# Altium schematic sheet USB.SchDoc
size 558 x 431 mm; SheetNumber: 16; SheetTotal: 25; Sheet_Name: USB; Size: 11x17
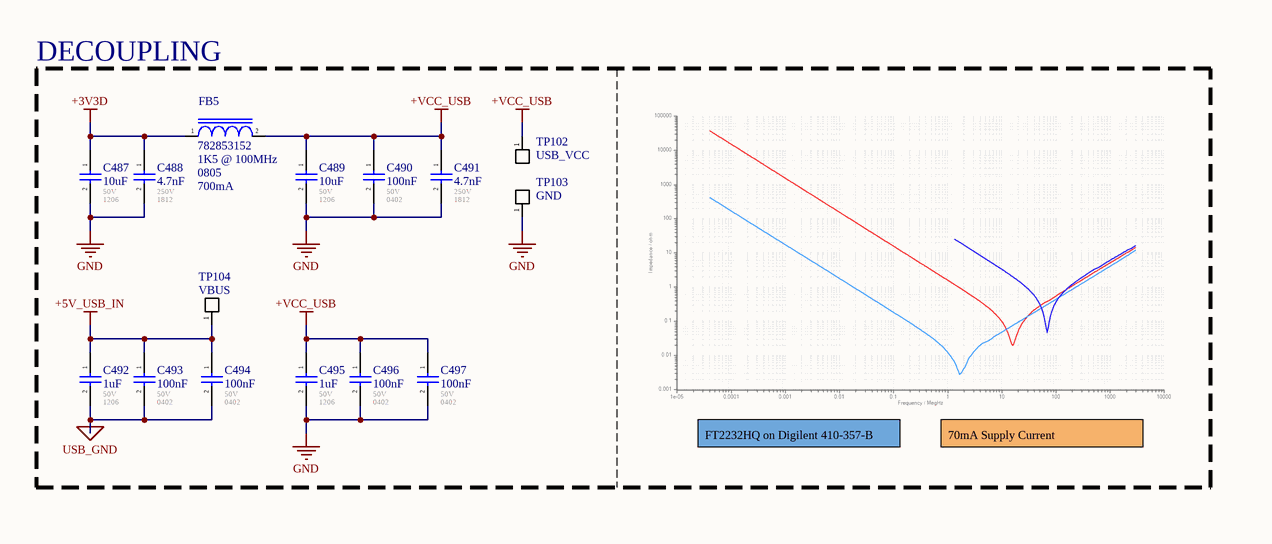
[diagram p0: USB.SchDoc, top left]
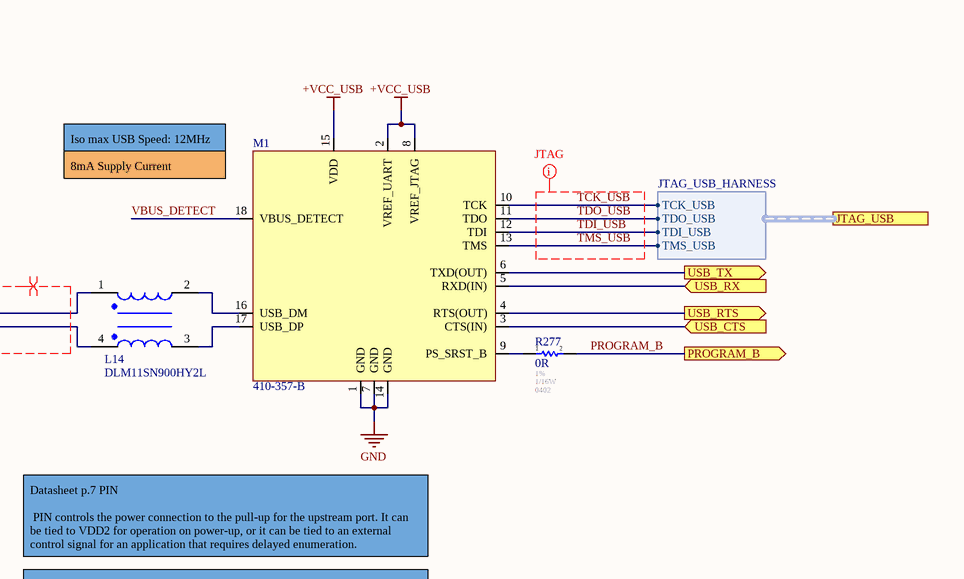
[diagram p1: USB.SchDoc, top right]
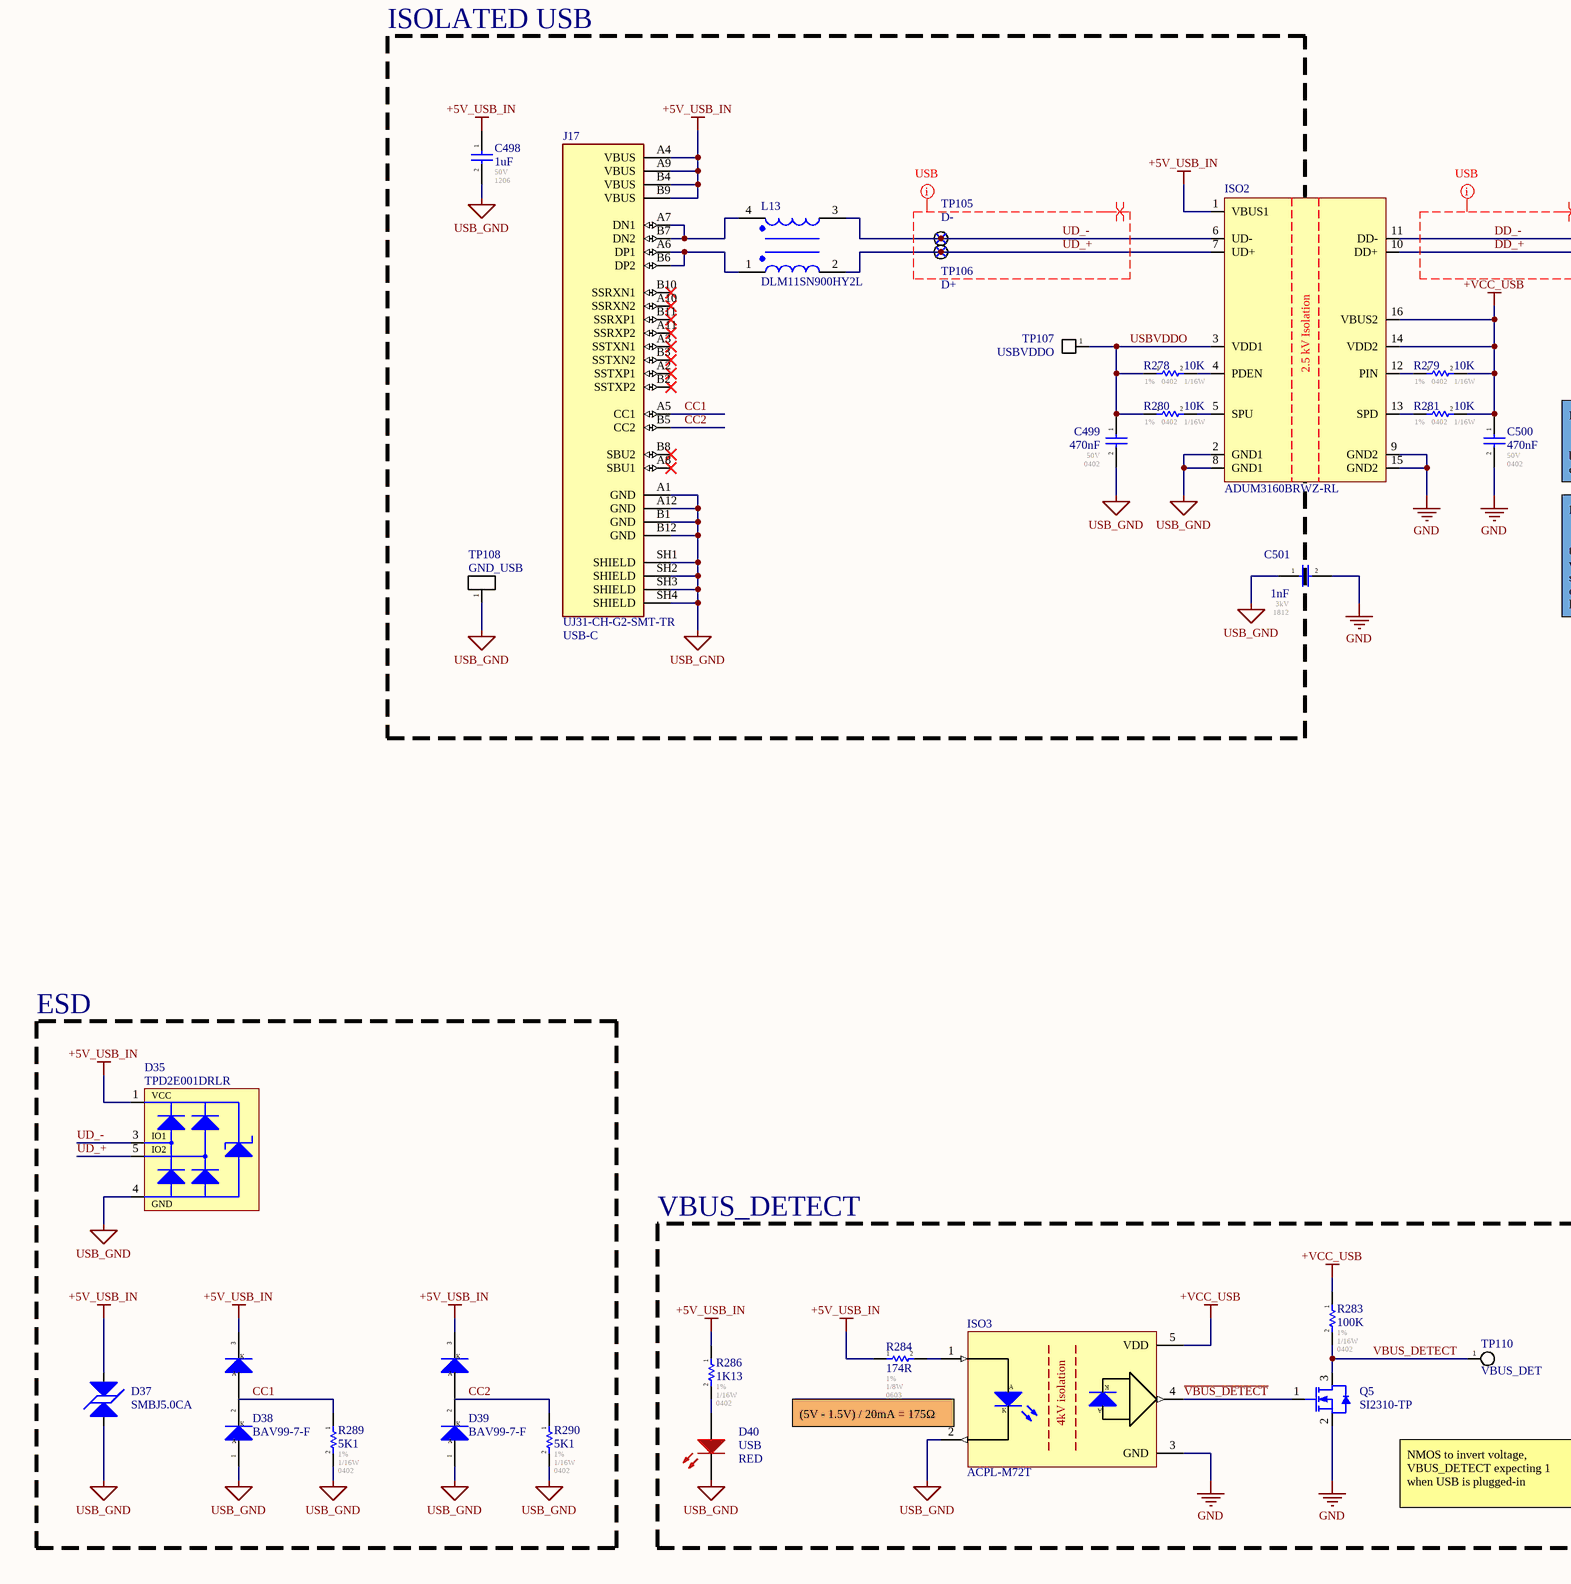
[diagram p2: USB.SchDoc, bottom left]
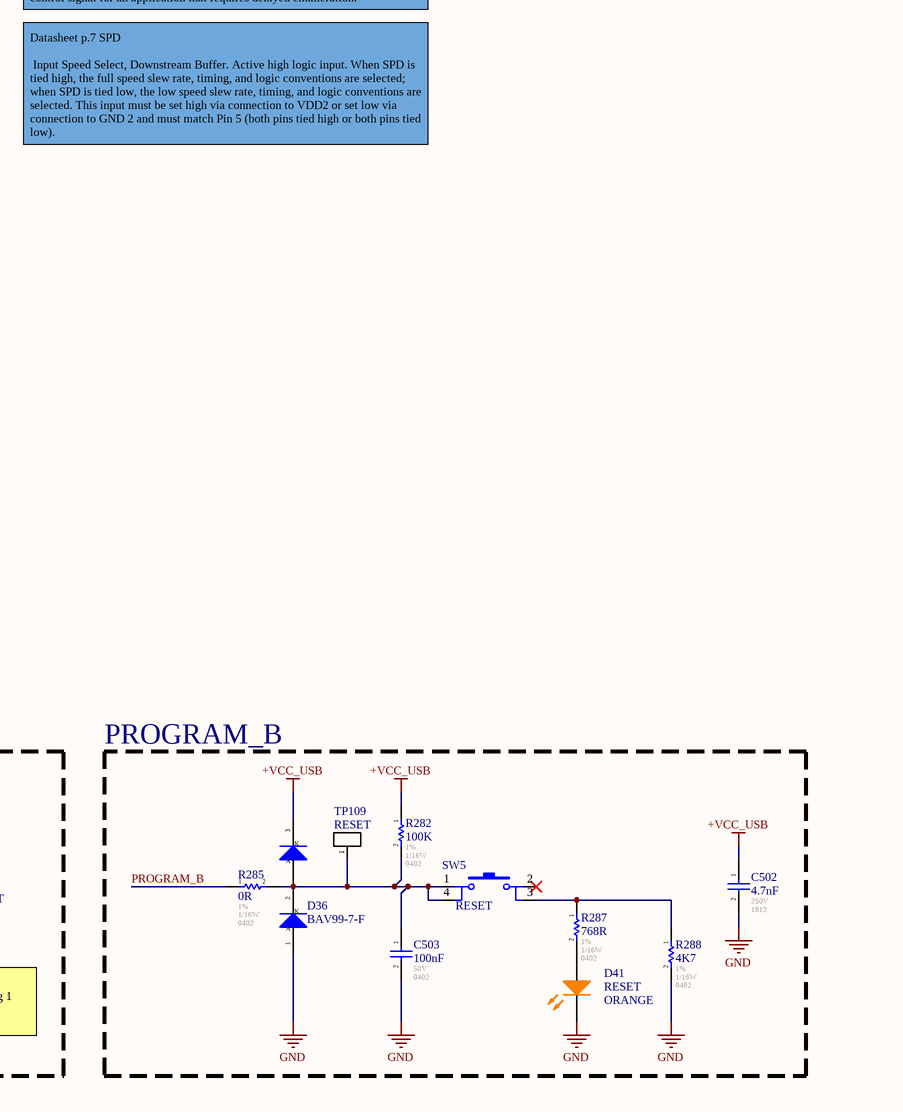
[diagram p3: USB.SchDoc, bottom right]

## Parts
C487  10uF  Voltage - Rated: 50V  Footprint: 1206  [CAP_1206]
C488  4.7nF  Voltage - Rated: 250V  Footprint: 1812  [CAP_1812]
C489  10uF  Voltage - Rated: 50V  Footprint: 1206  [CAP_1206]
C490  100nF  Voltage - Rated: 50V  Footprint: 0402  [CAP_0402]
C491  4.7nF  Voltage - Rated: 250V  Footprint: 1812  [CAP_1812]
C492  1uF  Voltage - Rated: 50V  Footprint: 1206  [CAP_1206]
C493  100nF  Voltage - Rated: 50V  Footprint: 0402  [CAP_0402]
C494  100nF  Voltage - Rated: 50V  Footprint: 0402  [CAP_0402]
C495  1uF  Voltage - Rated: 50V  Footprint: 1206  [CAP_1206]
C496  100nF  Voltage - Rated: 50V  Footprint: 0402  [CAP_0402]
C497  100nF  Voltage - Rated: 50V  Footprint: 0402  [CAP_0402]
C498  1uF  Voltage - Rated: 50V  Footprint: 1206  [CAP_1206]
C499  470nF  Voltage - Rated: 50V  Footprint: 0402  [CAP_0402]
C500  470nF  Voltage - Rated: 50V  Footprint: 0402  [CAP_0402]
C501  1nF  Voltage - Rated: 3kV  Footprint: 1812  [CAP_1812]
C502  4.7nF  Voltage - Rated: 250V  Footprint: 1812  [CAP_1812]
C503  100nF  Voltage - Rated: 50V  Footprint: 0402  [CAP_0402]
D35  TPD2E001DRLR  [TVS_USB_TPD2E001DRLR]
D36  BAV99-7-F  [SOT23-3]
D37  SMBJ5.0CA  [TVS_PWR_SMBJ5.0CA]
D38  BAV99-7-F  [SOT23-3]
D39  BAV99-7-F  [SOT23-3]
D40  USB  value RED  [LED_0603]
D41  RESET  value ORANGE  [LED_0603]
FB5  782853152  Impedance @ Freq: 1K5 @ 100MHz  Package / Case: 0805  Current Rating: 700mA  [IND_0805]
ISO2  ADUM3160BRWZ-RL  [ISO_ADUM3160BRWZ-RL]
ISO3  ACPL-M72T  [SOIC-5_4.4MM]
J17  UJ31-CH-G2-SMT-TR  Connector Type: USB-C  [UJ31-CH-G2-SMT-TR]
L13  DLM11SN900HY2L  [DLM11SN900HY2L]
L14  DLM11SN900HY2L  [DLM11SN900HY2L]
M1  410-357-B  [MOD_JTAG_410-357-B]
Q5  SI2310-TP  [TRX_NMOS_SI2310-TP]
R277  0R  Tolerance: 1%  Power: 1/16W  Package / Case: 0402  [RES_0402]
R278  10K  Tolerance: 1%  Power: 1/16W  Package / Case: 0402  [RES_0402]
R279  10K  Tolerance: 1%  Power: 1/16W  Package / Case: 0402  [RES_0402]
R280  10K  Tolerance: 1%  Power: 1/16W  Package / Case: 0402  [RES_0402]
R281  10K  Tolerance: 1%  Power: 1/16W  Package / Case: 0402  [RES_0402]
R282  100K  Tolerance: 1%  Power: 1/16W  Package / Case: 0402  [RES_0402]
R283  100K  Tolerance: 1%  Power: 1/16W  Package / Case: 0402  [RES_0402]
R284  174R  Tolerance: 1%  Power: 1/8W  Package / Case: 0603  [RES_0603]
R285  0R  Tolerance: 1%  Power: 1/16W  Package / Case: 0402  [RES_0402]
R286  1K13  Tolerance: 1%  Power: 1/16W  Package / Case: 0402  [RES_0402]
R287  768R  Tolerance: 1%  Power: 1/16W  Package / Case: 0402  [RES_0402]
R288  4K7  Tolerance: 1%  Power: 1/16W  Package / Case: 0402  [RES_0402]
R289  5K1  Tolerance: 1%  Power: 1/16W  Package / Case: 0402  [RES_0402]
R290  5K1  Tolerance: 1%  Power: 1/16W  Package / Case: 0402  [RES_0402]
SW5  RESET  [SWI_TACT_B3SN-3012P]
TP102  USB_VCC  [TP_PAD]  (no BOM)
TP103  GND  [TP_PAD]  (no BOM)
TP104  VBUS  [TP_PAD]  (no BOM)
TP105  D-  [TP_PAD_TINY]  (no BOM)
TP106  D+  [TP_PAD_TINY]  (no BOM)
TP107  USBVDDO  [TP_PAD]  (no BOM)
TP108  GND_USB  [TP_HOLE]  (no BOM)
TP109  RESET  [TP_HOLE]  (no BOM)
TP110  VBUS_DET  [TP_PAD_SMALL]  (no BOM)

## Blocks framed on the sheet
DECOUPLING: C487-C497 FB5 TP102-TP104
ISOLATED USB: C498 C499 J17 L13 R278 R280 TP105-TP108
ESD: D35 D37-D39 R289 R290
VBUS_DETECT: D40 ISO3 Q5 R283 R284 R286 TP110
PROGRAM_B: C502 C503 D36 D41 R282 R285 R287 R288 SW5 TP109

## Ports
JTAG_USB (harness JTAG_USB_HARNESS), PROGRAM_B (out), USB_CTS (in), USB_RTS (out), USB_RX (in), USB_TX (out)

## Harnesses
JTAG_USB_HARNESS: TCK_USB, TDO_USB, TDI_USB, TMS_USB

## Nets
+3V3D: C487.1 C488.1 FB5.1
+5V_USB_IN: C492.1 C493.1 C494.1 C498.1 D35.1(VCC) D37.1 D38.3(K) D39.3(K) ISO2.1(VBUS1) J17.A4(VBUS) J17.A9(VBUS) J17.B4(VBUS) J17.B9(VBUS) R284.1 R286.1 TP104.1(A)
+VCC_USB: C489.1 C490.1 C491.1 C495.1 C496.1 C497.1 C500.1 C502.1 D36.3(K) FB5.2 ISO2.14(VDD2) ISO2.16(VBUS2) ISO3.5(VDD) M1.2(VREF_UART) M1.8(VREF_JTAG) M1.15(VDD) R279.2 R281.2 R282.1 R283.1 TP102.1(A)
GND: C487.2 C488.2 C489.2 C490.2 C491.2 C495.2 C496.2 C497.2 C500.2 C501.2 C502.2 C503.2 D36.1(A) D41.2(K) ISO2.9(GND2) ISO2.15(GND2) ISO3.3(GND) M1.1(GND) M1.7(GND) M1.14(GND) Q5.2(S) R288.2 TP103.1(A)
USB_GND: C492.2 C493.2 C494.2 C498.2 C499.2 C501.1 D35.4(GND) D37.2 D38.1(A) D39.1(A) D40.2(K) ISO2.2(GND1) ISO2.8(GND1) ISO3.2(CATHODE) J17.A1(GND) J17.A12(GND) J17.B1(GND) J17.B12(GND) J17.SH1(SHIELD) J17.SH2(SHIELD) J17.SH3(SHIELD) J17.SH4(SHIELD) R289.2 R290.2 TP108.1(A)
~{VBUS_DETECT}: ISO3.4(VOUT) Q5.1(G)
CC1: D38.2(K) J17.A5(CC1) R289.1
CC2: D39.2(K) J17.B5(CC2) R290.1
DD_+: ISO2.10(DD+) L14.4
DD_-: ISO2.11(DD-) L14.1
PROGRAM_B: R277.2 R285.1 ; port PROGRAM_B
TCK_USB: M1.10(TCK) ; port JTAG_USB.TCK_USB
TDI_USB: M1.12(TDI) ; port JTAG_USB.TDI_USB
TDO_USB: M1.11(TDO) ; port JTAG_USB.TDO_USB
TMS_USB: M1.13(TMS) ; port JTAG_USB.TMS_USB
UD_+: D35.5(IO2) ISO2.7(UD+) L13.2 TP106.1(A)
UD_-: D35.3(IO1) ISO2.6(UD-) L13.3 TP105.1(A)
USB_CTS: M1.3(CTS(IN)) ; port USB_CTS
USB_RTS: M1.4(RTS(OUT)) ; port USB_RTS
USB_RX: M1.5(RXD(IN)) ; port USB_RX
USB_TX: M1.6(TXD(OUT)) ; port USB_TX
USBVDDO: C499.1 ISO2.3(VDD1) R278.1 R280.1 TP107.1(A)
VBUS_DETECT: M1.18(VBUS_DETECT) Q5.3(D) R283.2 TP110.1(A)
NetC503_1: C503.1 D36.2(K) R282.2 R285.2 SW5.1 SW5.4 TP109.1(A)
NetD40_1: D40.1(A) R286.2
NetD41_1: D41.1(A) R287.2
NetISO2_4: ISO2.4(PDEN) R278.2
NetISO2_5: ISO2.5(SPU) R280.2
NetISO2_12: ISO2.12(PIN) R279.1
NetISO2_13: ISO2.13(SPD) R281.1
NetISO3_1: ISO3.1(ANODE) R284.2
NetJ17_A6: J17.A6(DP1) J17.B6(DP2) L13.1
NetJ17_A7: J17.A7(DN1) J17.B7(DN2) L13.4
NetL14_2: L14.2 M1.16(USB_DM)
NetL14_3: L14.3 M1.17(USB_DP)
NetM1_9: M1.9(PS_SRST_B) R277.1
NetR287_1: R287.1 R288.1 SW5.3

Not connected (* = marked no-connect by the designer): D35 2(NC); J17 A2(SSTXP1)* A3(SSTXN1)* A8(SBU1)* A10(SSRXN2)* A11(SSRXP2)* B2(SSTXP2)* B3(SSTXN2)* B8(SBU2)* B10(SSRXN1)* B11(SSRXP1)*; SW5 2*

## Layout directives
net class USB: DD_+, DD_-, UD_+, UD_-
differential pair: DD_+, DD_-, UD_+, UD_-
net class JTAG: TCK_USB, TDI_USB, TDO_USB, TMS_USB

## Notes on the sheet
- FT2232HQ on Digilent 410-357-B
- 70mA Supply Current
- (near M1) Iso max USB Speed: 12MHz
- (near M1) 8mA Supply Current
- Datasheet p.7 PIN
  PIN controls the power connection to the pull-up for the upstream port. It can be tied to VDD2 for operation on power-up, or it can be tied to an external control signal for an application that requires delayed enumeration.
- Datasheet p.7 SPD
  Input Speed Select, Downstream Buffer. Active high logic input. When SPD is tied high, the full speed slew rate, timing, and logic conventions are selected; when SPD is tied low, the low speed slew rate, timing, and logic conventions are selected. This input must be set high via connection to VDD2 or set low via connection to GND 2 and must match Pin 5 (both pins tied high or both pins tied low).
- (near ISO3) (5V - 1.5V) / 20mA = 175Ω
- NMOS to invert voltage, VBUS_DETECT expecting 1 when USB is plugged-in
- Sheet Name
- Project Title
- Global Project
- Revision
- Size
- Date
- Group
- Sheet
- of
- Filename
- Designers
- (in symbol ACPL-M72T) A; K; 4kV isolation
- (in symbol ISO_ADUM3160BRWZ-RL) 2.5 kV Isolation

## Library data of the parts
C487 C489 = CAP_CER: GRT31CR61H106KE01L / 1206 10uF 10% X5R Ceramic Capacitor; Mfr: Murata; Operating Temperature: -55C - 85C; Temperature Coefficient: X5R; ComponentLink1Description: Digikey; ComponentLink2Description: Datasheet; Tolerance: 10%; Ratings: AEC-Q200; Part#: GRT31CR61H106KE01L
  C487: ComponentLink1URL: https://www.digikey.ca/en/products/detail/murata-electronics/GRT31CR61H106KE01L/5416878; ComponentLink2URL: https://search.murata.co.jp/Ceramy/image/img/A01X/G101/ENG/GRT31CR61H106KE01-01.pdf; ComponentLink3Description: Octopart; ComponentLink3URL: https://octopart.com/grt31cr61h106ke01l-murata-62921736; ComponentLink4Description: Murata; ComponentLink4URL: https://www.murata.com/en-us/products/productdetail?partno=GRT31CR61H106KE01%23
  C489: ComponentLink1URL: [Digikey Link]; ComponentLink2URL: [Datasheet Link]
C488 C491 C502 = CAP_CER: GA343DR7GD472KW01L / 0402 4.7nF 10% X7R 1812 250VAC Ceramic Capacitor; Mfr: Murata; Ratings: Y3 - Safety; Operating Temperature: -55C - 125C; Temperature Coefficient: X7R; ComponentLink1Description: Digikey; ComponentLink1URL: https://www.digikey.ca/en/products/detail/murata-electronics/GA343DR7GD472KW01L/789292; ComponentLink2Description: Datasheet; ComponentLink2URL: https://search.murata.co.jp/Ceramy/image/img/A01X/G101/ENG/GA343DR7GD472KW01-01.pdf; ComponentLink3Description: Octopart; ComponentLink3URL: https://octopart.com/ga343dr7gd472kw01l-murata-197048?r=sp; Tolerance: 10%; Part#: GA343DR7GD472KW01L
  C502: ComponentLink4Description: Murata; ComponentLink4URL: https://www.murata.com/en-us/products/productdetail?partno=GA343DR7GD472KW01%23
C490 C493 C494 C496 C497 C503 = CAP_CER: GCM155R71H104KE02J / 0402 100nF 10% X7R Ceramic Capacitor; Mfr: Murata; Operating Temperature: -55C - 125C; Temperature Coefficient: X7R; ComponentLink1Description: Digikey; ComponentLink1URL: [Digikey Link]; Part#: GCM155R71H104KE02J; ComponentLink2Description: Datasheet; ComponentLink2URL: [Datasheet Link]; Tolerance: 10%; Ratings: AEC-Q200
C492 C495 C498 = CAP_CER: GCJ31CR71H105KA12L / 1206 1uF 10% X7R Ceramic Capacitor; Mfr: Murata; Operating Temperature: -55C - 125C; Temperature Coefficient: X7R; ComponentLink1Description: Digikey; Part#: GCJ31CR71H105KA12L; ComponentLink2Description: Datasheet; Tolerance: 10%; Ratings: AEC-Q200
  C492: ComponentLink1URL: https://www.digikey.ca/en/products/detail/murata-electronics/GCJ31CR71H105KA12L/10690321; ComponentLink2URL: https://search.murata.co.jp/Ceramy/image/img/A01X/G101/ENG/GCJ31CR71H105KA12-02B.pdf; ComponentLink3Description: Octopart; ComponentLink3URL: https://octopart.com/gcj31cr71h105ka12l-murata-57352446?r=sp; ComponentLink4Description: Murata; ComponentLink4URL: https://www.murata.com/en-us/products/productdetail?partno=GCJ31CR71H105KA12%23
  C495 C498: ComponentLink1URL: [Digikey Link]; ComponentLink2URL: [Datasheet Link]
C499 C500 = CAP_CER: CGA3E3X7R1H474K080AB / 0603 470nF 10% X7R Ceramic Capacitor; Mfr: TDK; Operating Temperature: -55C - 125C; Temperature Coefficient: X7R; ComponentLink1Description: Digikey; Part#: CGA3E3X7R1H474K080AB; ComponentLink2Description: Datasheet; Tolerance: 10%; Ratings: AEC-Q200
  C499: ComponentLink1URL: https://www.digikey.ca/en/products/detail/murata-electronics/GCM21BR71H474KA55L/1641662; ComponentLink2URL: https://search.murata.co.jp/Ceramy/image/img/A01X/G101/ENG/GCM21BR71H474KA55-01A.pdf; ComponentLink3Description: Octopart; ComponentLink3URL: https://octopart.com/gcm21br71h474ka55l-murata-7894857; ComponentLink4Description: Murata; ComponentLink4URL: https://www.murata.com/en-us/products/productdetail?partno=GCM21BR71H474KA55%23
  C500: ComponentLink1URL: [Digikey Link]; ComponentLink2URL: [Datasheet Link]
C501 = CAP_CER: C1812C102KHRACAUTO / 0402 470pF 10% X7R Ceramic Capacitor; Mfr: KEMET; Operating Temperature: -55C - 125C; Temperature Coefficient: X7R; ComponentLink1Description: Digikey; ComponentLink1URL: https://www.digikey.com/en/products/detail/kemet/C1812C102KHRACAUTO/8109956; Part#: C1812C102KHRACAUTO; ComponentLink2Description: Datasheet; ComponentLink2URL: https://connect.kemet.com:7667/gateway/IntelliData-ComponentDocumentation/1.0/download/datasheet/C1812C102KHRACAUTO; Tolerance: 10%; Ratings: AEC-Q200; ComponentLink3Description: KEMET; ComponentLink3URL: https://www.kemet.com/en/us/capacitors/ceramic/product/C1812C102KHRACAUTO.html; ComponentLink4Description: Octopart; ComponentLink4URL: https://octopart.com/c1812c102khracauto-kemet-67309371?r=sp; Features: Low ESL, High Voltage; Supplier 1: Mouser; Supplier Part Number 1: 80-C1812C102KHRAUTO
D35 = TVS_USB_TPD2E001DRLR: TVS - USB TVS DIODE 5.5V - SOT-553; Manufacturer #1: Texas Instruments; Value: 11V Breakdown; Voltage Rating: 5.5V (Max); GRAMS Lib Spec: 2.8; Magnetic Material: YES; Cryo: UNKNOWN; Tolerance: *; Current Rating: *; Power Max: *; HelpURL: http://www.ti.com/lit/ds/symlink/tpd2e001.pdf; CreatedBy/Date: Jonathan Bouchard 2018-07-10; VerifiedBy: Arnaud Samson 16-07-18; Temperature: -40°C ~ 85°C (TA); Package: SOT-553; Manufacturer #2: *; Note: *; Assembly Type: SMD; Part Number #2: *; Part Number #1: TPD2E001DRLR; Polarized: YES; Supplier 1: Digi-Key; Supplier Part Number 1: 296-21883-1-ND
D36 D38 D39 = DIODE_TVS_DUAL: Diode Array 1 Pair Series Connection 75 V 300mA (DC) Surface Mount TO-236-3, SC-59, SOT-23-3; Mfr: Diodes Incorporated; Voltage - DC Reverse: 75V; Voltage - Forward: 1.25V @ 150mA; Reverse Recovery Time: 4ns; Capacitance: 2pF; Current - Reverse Leakage: 2.5µA @ 75V; Operating Temperature: -65C - 150C; Package / Case: SOT-23-3; Current: 300mA; ComponentLink1Description: Digikey; ComponentLink1URL: https://www.digikey.ca/en/products/detail/diodes-incorporated/BAV99-7-F/815018; ComponentLink2Description: Datasheet; ComponentLink2URL: https://www.diodes.com/assets/Datasheets/BAV99.pdf; ComponentLink3Description: Octopart; ComponentLink3URL: https://octopart.com/bav99-7-f-diodes+inc.-326328; Supplier 1: Future Electronics; Supplier Part Number 1: 3851920
D37 = TVS_PWR_SMBJ5.0CA: TVS - BIDIR 5V 9.2V 600W - DO214AA; Manufacturer #1: Littelfuse Inc.; Value: Vbr = 6.4V -  Clamp = 9.2V; Voltage Rating: 5V Standoff; Current Rating: 65.3 A (Ipp); Power Max: 600W (Pppm); GRAMS Lib Spec: 2.8; Magnetic Material: UNKNOWN; Polarized: NO; Tolerance: *; HelpURL: http://www.littelfuse.com/~/media/electronics/datasheets/tvs_diodes/littelfuse_tvs_diode_smbj_datasheet.pdf.pdf; CreatedBy/Date: Jonathan Bouchard - 2019-03-22; VerifiedBy: Nicolas V. (2019-05-06); Temperature: -65°C ~ 150°C (TJ); Package: DO214AA; Manufacturer #2: *; Note: *; Assembly Type: SMD; Part Number #2: *; Part Number #1: SMBJ5.0CA; Supplier 1: Digi-Key; Supplier Part Number 1: SMBJ5.0CALFCT-ND; Cryo: UNKNOWN
D40 = LED_SML-311UTT86: LED - 620nM RED 2mA - 0603; Voltage: 1.8V; Mfg: ROHM Semiconductor; Power: 44mW; Current: 2mA; HelpURL: http://media.digikey.com/pdf/Data%20Sheets/Rohm%20PDFs/SML-311%20Series.pdf; CreatedBy: Jonathan Bouchard; Temperature: -30°C to 85°C; Package: 0603; Precision: *; Mfg Part Number: SML-311UTT86; Supplier 1: Digikey; Supplier Part Number 1: 511-1304-1-ND
D41 = LED_SML-311DTT86: LED - 611nM ORANGE 2mA - 0603; Voltage: 1.8V; Mfg: ROHM Semiconductor; Power: 44mW; Current: 2mA; HelpURL: http://media.digikey.com/pdf/Data%20Sheets/Rohm%20PDFs/SML-311%20Series.pdf; CreatedBy: Jonathan Bouchard; Temperature: -40°C to 85°C; Package: 0603; Precision: *; Mfg Part Number: SML-311DTT86; Supplier 1: Digikey; Supplier Part Number 1: 511-1303-1-ND
FB5 = FERRITE_BEAD: 600 Ohms @ 100 MHz 1 Signal Line Ferrite Bead 0603 (1608 Metric) 1A 200mOhm; Manufacturer: Wurth Elektronik; Resistance: 350mR; Operating Temperature: -55C - 125C; Rating: AEC-Q200; ComponentLink1Description: Digikey; ComponentLink1URL: https://www.digikey.ca/en/products/detail/w%C3%BCrth-elektronik/782853152/5168812; ComponentLink3Description: Octopart; ComponentLink3URL: https://octopart.com/782853152-wurth+elektronik-56466774?r=sp; ComponentLink5Description: Datasheet; ComponentLink5URL: https://www.we-online.com/en/components/products/datasheet/782853152.pdf
ISO2 = ISO_ADUM3160BRWZ-RL: ISO - DGTL ISO 2.5KV 2CH USB - 16SOIC; Manufacturer #1: Analog Devices; Value: 2500Vrms voltage isolation; Voltage Rating: 3~5.5V; GRAMS Lib Spec: 2.8; Magnetic Material: UNKNOWN; Polarized: Yes; Tolerance: *; Current Rating: *; Power Max: *; HelpURL: https://www.analog.com/media/en/technical-documentation/data-sheets/ADuM3160.pdf; CreatedBy/Date: Tommy Rossignol 2018-11-16; VerifiedBy: Caroline Paulin - 13 février 2019; Temperature: -40°C ~ 105°C; Package: 16-SOIC; Manufacturer #2: *; Assembly Type: SMD; Part Number #2: *; Part Number #1: ADUM3160BRWZ-RL; Supplier 1: Digi-Key; Supplier Part Number 1: ADUM3160BRWZ-RLCT-ND; Cryo: UNKNOWN
ISO3 = ACPL-M72T: Logic Output Optoisolator Push-Pull, Totem Pole 4000Vrms 1 Channel 25kV/µs CMTI 5-SO; Mfr: Broadcom Limited; Number of channels: 1; Common Mode Transient: 25kV/us; Voltage - Forward: 1.5V; Current - Forward: 20mA; Voltage - Supply: 3V - 5.5V; Qualification: AEC-Q100; Voltage - Isolation: 4000Vrms; Output Topology: Push-Pull; Operating Temperature: -40C - 125C; Package: SOIC6 - 5 Leads; ComponentLink1Description: Digikey; ComponentLink1URL: https://www.digikey.ca/en/products/detail/broadcom-limited/ACPL-M72T-000E/2347227; ComponentLink2Description: Datasheet; ComponentLink2URL: https://docs.broadcom.com/doc/AV02-2180EN
J17 = CONN_UJ31-CH-G2-SMT-TR: Type C, USB 3.1 Gen 2, 5 A, Right Angle, Surface Mount _SMT_, USB Receptacle; Mfr: CUI Devices; Number of Contacts: 24; Specifications: USB 3.2 Gen 2 (USB 3.1 Gen 2, Superspeed + (USB 3.1)); Current Rating: 6.25A; Voltage Rating: 20V; Operating Temperature: -25C - 80C; Digikey Part Number: 102-4483-1-ND; ComponentLink1Description: Digikey; ComponentLink1URL: https://www.digikey.ca/en/products/detail/cui-devices/UJ31-CH-G2-SMT-TR/8024057; Supplier 1: Digi-Key; Supplier Part Number 1: 102-4483-1-ND
L13 L14 = IND_DLM11SN900HY2L: 2 Line Common Mode Choke Surface Mount 90 Ohms @ 100MHz 100mA DCR 1.38Ohm; Voltage Rating: 5V; Impedance: 90 Ohms @ 100MHz; Current Rating: 100mA; DC resistance: 1.38Ohm; Operating Temperature: -40C - 85C; Package: 0504; Supplier 1: Digi-Key; Supplier Part Number 1: 490-11941-1-ND
M1 = MOD_JTAG_410-357-B: MOD - JTAG-SMT3-NC Programming Module For Xilinx FPGA - 18-SMT; Manufacturer #1: Digilent; Voltage Rating: VDD: 2.97V~3.63V, VJTAG/VUART: 1.65V~5.5V; GRAMS Lib Spec: 2.8; Note: Prior to reflow, the JTAG-SMT3-NC module must be dried at 125°C for 17 hours; Magnetic Material: Unknown; Polarized: Yes; Value: *; Tolerance: *; Current Rating: *; Power Max: *; HelpURL: https://reference.digilentinc.com/_media/reference/programmers/jtag-smt3/jtag-smt3-nc_rm.pdf; CreatedBy/Date: Tommy Rossignol 2018-11-23; VerifiedBy: Nicolas V. (2019-01-28); Temperature: -40°C ~ 85°C; Package: 18-pad SMT; Manufacturer #2: *; Assembly Type: SMD; Part Number #2: *; Part Number #1: 410-357-B; Supplier 1: Digi-Key; Supplier Part Number 1: 1286-1196-ND; Cryo: UNKNOWN
Q5 = TRX_NMOS_SI2310-TP: TRX - MOSFET N-CH 60V 3A - SOT-23; Manufacturer #1: Micro Commercial Co; Power Max: 350mW; Voltage rating: 60V (Vds max), 2V (Vgs @ 250uA); Polarized: Yes; Magnetic Material: UNKNOWN; GRAMS Lib Spec: 2.8c; Current Rating: 3A; Manufacturer #2: *; Value: *; Part Number #1: SI2310-TP; Part Number #2: *; HelpURL: https://www.mccsemi.com/pdf/Products/SI2310(SOT-23)-A.pdf; Supplier 1: Digi-Key; Supplier Part Number 1: SI2310-TPMSCT-ND; Assembly Type: SMD; Temperature: -55°C ~ 150°C (TJ); Package: SOT-23; CreatedBy/Date: Louis-Daniel Gaulin / 20-02-2020; Tolerance: *; VerifiedBy: C.Paulin - 21/02/2020; Cryo: UNKNOWN
R277-R290 = RESISTOR: Automotive: AEC-Q200; Operating Temperature: *; # Digikey: *; ComponentLink1Description: Digikey; ComponentLink1URL: *; # Manufacturer: *
SW5 = SWI_TACT_B3SN-3012P: SWI - TACT SPST-NO 0.05A 24V - 4-SMD; Current: 50mA; Mfg: Omron; Mfg Part Number: B3SN-3012P; HelpURL: http://www.omron.com/ecb/products/pdf/en-b3sn.pdf; CreatedBy: Jonathan Bouchard; Temperature: -25°C ~ 70°C; Power: *; Precision: *; Package: 4-SMD; Value: *; Voltage: 24V; Supplier 1: Digikey; Supplier Part Number 1: SW261CT-ND
TP102-TP104 TP107 = TESTPOINT_PAD: Test Point
TP105 TP106 = TESTPOINT_PAD_TINY: Test Point
TP108 TP109 = TESTPOINT: Test Point; ClassName: Testpoint
TP110 = TESTPOINT_PAD_SMALL: Test Point